# Altium schematic sheet JapaneseLayout_OJP_V0_1_Page_1.SchDoc: Design -> Document Options
size B; Organization: OLogic, Inc.; Revision: A; SheetNumber: 1; SheetTotal: 2; PageSetup: Record=PageOptions|CenterHorizontal=True|CenterVertical=True|PrintScale=0.95|XCorrection=1.00|YCorrection=1.00|PrintKind=1|BorderSize=5000000|LeftOffset=0|BottomOffset=0|Orientation=2|PaperLength=1000|PaperWidth=1000|Scale=100|PaperSource=7|PrintQuality=-4|MediaType=1|DitherType=10|PaperKind=Letter|PrintScaleMode=1
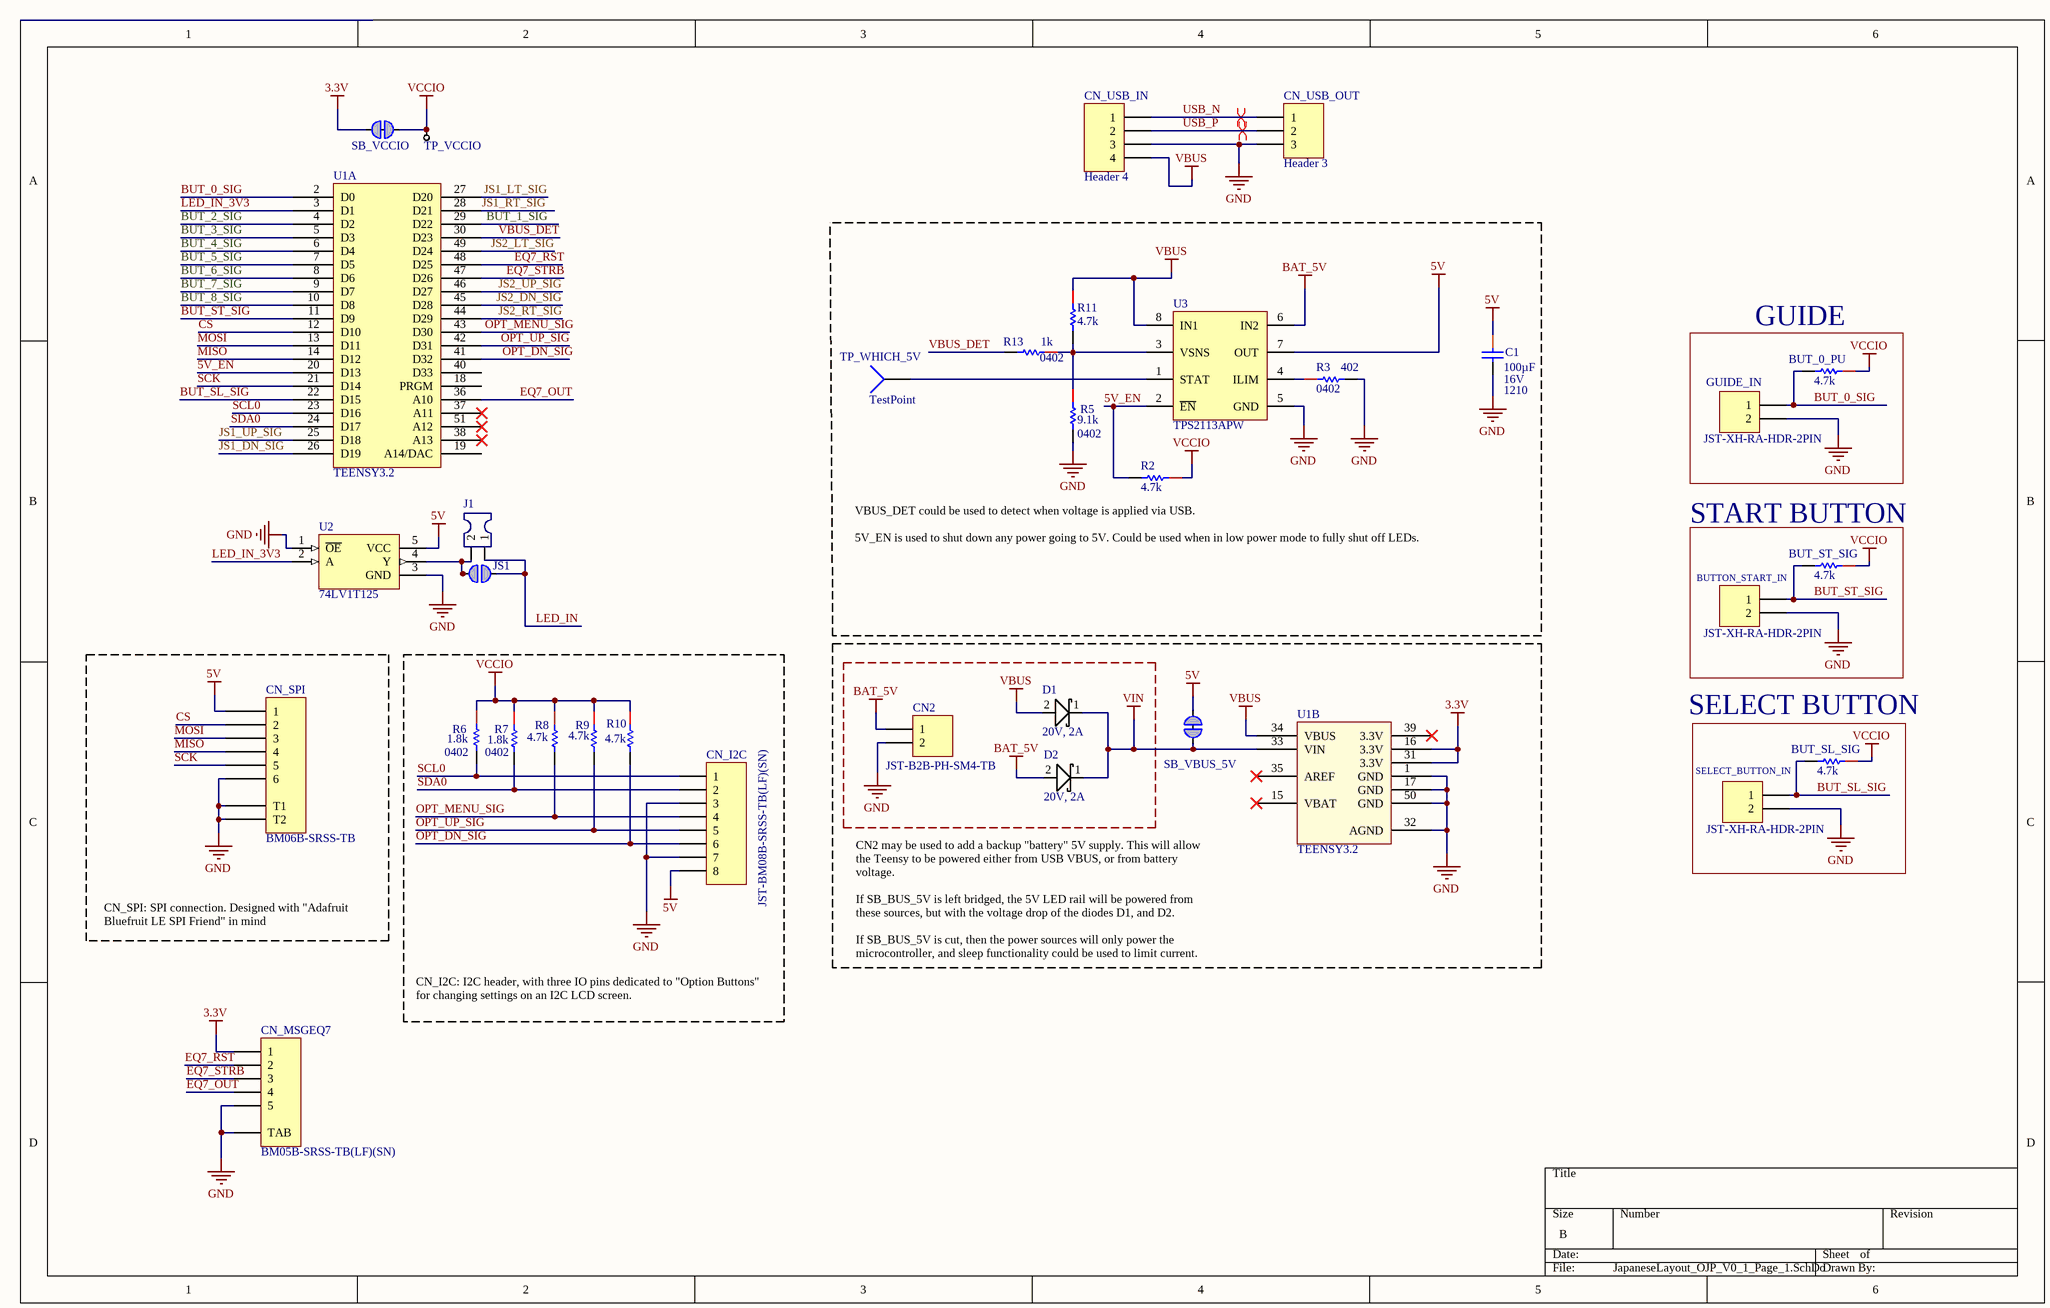
[diagram p0: JapaneseLayout_OJP_V0_1_Page_1.SchDoc]

## Parts
BUT_0_PU  4.7K  [RESC0402(1005)_N]  (no BOM)
BUT_SL_SIG  4.7K  [RESC0402(1005)_N]  (no BOM)
BUT_ST_SIG  4.7K  [RESC0402(1005)_N]  (no BOM)
BUTTON_START_IN  JST-XH-RA-HDR-2PIN  [JST-XH-RA-HDR-2PIN]
C1  Capacitance: 100µF  Voltage - Rated: 16V  Package / Case: 1210  [CAPC1210(3225)_N]  (hidden comment: CAP CER 100UF 16V 20% X5R 1210)
CN2  JST-B2B-PH-SM4-TB  [JST-B2B-PH-SM4-TB]
CN_I2C  JST-BM08B-SRSS-TB(LF)(SN)  [JST-BM08B-SRSS-TB]
CN_MSGEQ7  BM05B-SRSS-TB(LF)(SN)  [New footprint 1]
CN_SPI  BM06B-SRSS-TB  [JST-BM06B-SRSS-TB]
CN_USB_IN  Header 4  [HDR1X4]
CN_USB_OUT  Header 3  [HDR1X3]
D1  Diode - Schottky, 20V, 2A  [DFN80P160X40-2N - PMEG2020EPK,315]  (value not drawn)
D2  Diode - Schottky, 20V, 2A  [DFN80P160X40-2N - PMEG2020EPK,315]  (value not drawn)
GUIDE_IN  JST-XH-RA-HDR-2PIN  [JST-XH-RA-HDR-2PIN]
J1  Jumper 2-Pin  [HDR1X2]  (value not drawn)
JS1  SOLDERBRIDGE  [Solderbridge]  (value not drawn)  (no BOM)
R2  4.7K  [RESC0402(1005)_N]  (no BOM)
R3  Package (Imperial): 0402  [RESC1005X40X25NL05T10]  (hidden comment: 402)
R5  Package (Imperial): 0402  [RESC0402(1005)_M]  (hidden comment: 9.1k)
R6  Package (Imperial): 0402  [RESC0402(1005)_L]  (hidden comment: 1.8K)
R7  Package (Imperial): 0402  [RESC0402(1005)_L]  (hidden comment: 1.8K)
R8  4.7K  [RESC0402(1005)_N]  (no BOM)
R9  4.7K  [RESC0402(1005)_N]  (no BOM)
R10  4.7K  [RESC0402(1005)_N]  (no BOM)
R11  4.7K  [RESC0402(1005)_N]  (no BOM)
R13  Resistance: 1k  Package (Imperial): 0402  [RESC0402(1005)_L]  (hidden comment: RES SMD 1K OHM 1% 1/16W 0402)
SB_VBUS_5V  SOLDERBRIDGE_SHORTED  [Solderbridge_Shorted]  (value not drawn)  (net tie, no BOM)
SB_VCCIO  SOLDERBRIDGE_SHORTED  [Solderbridge_Shorted]  (value not drawn)  (net tie, no BOM)
SELECT_BUTTON_IN  JST-XH-RA-HDR-2PIN  [JST-XH-RA-HDR-2PIN]
TP_VCCIO  TestPoint-PC-W  [TestPoint-TH 40 mil]  (value not drawn)
TP_WHICH_5V  TestPoint  [TestPoint-SM]  (no BOM)
U1  TEENSY3.2  [TEENSY3.2]  (parts A,B of 2)
U2  74LV1T125  [5-TSSOP, SC-70-5, SOT-353]
U3  TPS2113APW  [TSSOP-8, 3x4.40mm]

## Blocks framed on the sheet
GUIDE: BUT_0_PU GUIDE_IN
START BUTTON: BUT_ST_SIG BUTTON_START_IN

## Nets
3.3V: CN_MSGEQ7.1 SB_VCCIO.2 U1.16(3.3V) U1.31(3.3V)
5V: C1.1 CN_I2C.8 CN_SPI.1 SB_VBUS_5V.1 U2.5(VCC) U3.7(OUT)
BAT_5V: CN2.1 D2.2 U3.6(IN2)
GND: BUTTON_START_IN.2 C1.2 CN2.0 CN2.2 CN_I2C.0 CN_I2C.3 CN_I2C.7 CN_MSGEQ7.0(TAB) CN_MSGEQ7.5 CN_SPI.6 CN_SPI.T1 CN_SPI.T2 CN_USB_IN.3 CN_USB_OUT.3 GUIDE_IN.2 R3.2 R5.2 SELECT_BUTTON_IN.2 U1.1(GND) U1.17(GND) U1.32(AGND) U1.50(GND) U2.1(~{OE}) U2.3(GND) U3.5(GND)
VBUS: CN_USB_IN.4 D1.2 R11.1 U1.34(VBUS) U3.8(IN1)
VCCIO: BUT_0_PU.1 BUT_SL_SIG.1 BUT_ST_SIG.1 R2.1 R6.1 R7.1 R8.1 R9.1 R10.1 SB_VCCIO.1 TP_VCCIO.1
VIN: D1.1 D2.1 SB_VBUS_5V.2 U1.33(VIN)
5V_EN: R2.2 U1.20(D13) U3.2(~{EN})
BUT_0_SIG: BUT_0_PU.2 GUIDE_IN.1 U1.2(D0)
BUT_1_SIG: U1.29(D22)
BUT_2_SIG: U1.4(D2)
BUT_3_SIG: U1.5(D3)
BUT_4_SIG: U1.6(D4)
BUT_5_SIG: U1.7(D5)
BUT_6_SIG: U1.8(D6)
BUT_7_SIG: U1.9(D7)
BUT_8_SIG: U1.10(D8)
BUT_SL_SIG: BUT_SL_SIG.2 SELECT_BUTTON_IN.1 U1.22(D15)
BUT_ST_SIG: BUT_ST_SIG.2 BUTTON_START_IN.1 U1.11(D9)
CS: CN_SPI.2 U1.12(D10)
EQ7_OUT: CN_MSGEQ7.4 U1.36(A10)
EQ7_RST: CN_MSGEQ7.2 U1.48(D25)
EQ7_STRB: CN_MSGEQ7.3 U1.47(D26)
JS1_DN_SIG: U1.26(D19)
JS1_LT_SIG: U1.27(D20)
JS1_RT_SIG: U1.28(D21)
JS1_UP_SIG: U1.25(D18)
JS2_DN_SIG: U1.45(D28)
JS2_LT_SIG: U1.49(D24)
JS2_RT_SIG: U1.44(D29)
JS2_UP_SIG: U1.46(D27)
LED_IN: J1.1 JS1.1
LED_IN_3V3: U1.3(D1) U2.2(A)
MISO: CN_SPI.4 U1.14(D12)
MOSI: CN_SPI.3 U1.13(D11)
OPT_DN_SIG: CN_I2C.6 R10.2 U1.41(D32)
OPT_MENU_SIG: CN_I2C.4 R8.2 U1.43(D30)
OPT_UP_SIG: CN_I2C.5 R9.2 U1.42(D31)
SCK: CN_SPI.5 U1.21(D14)
SCL0: CN_I2C.1 R6.2 U1.23(D16)
SDA0: CN_I2C.2 R7.2 U1.24(D17)
USB_N: CN_USB_IN.1 CN_USB_OUT.1
USB_P: CN_USB_IN.2 CN_USB_OUT.2
VBUS_DET: R13.2 U1.30(D23)
NetJ1_2: J1.2 JS1.2 U2.4(Y)
NetR3_1: R3.1 U3.4(ILIM)
NetR5_1: R5.1 R11.2 R13.1 U3.3(VSNS)
NetTP_WHICH_5V_1: TP_WHICH_5V.1 U3.1(STAT)

Not connected (* = marked no-connect by the designer): U1 15(VBAT)* 18(PRGM) 19(A14/DAC) 35(AREF)* 37(A11)* 38(A13)* 39(3.3V)* 40(D33) 51(A12)*

## Layout directives
differential pair: USB_N, USB_P

## Notes on the sheet
- (near R2) VBUS_DET could be used to detect when voltage is applied via USB.
  5V_EN is used to shut down any power going to 5V. Could be used when in low power mode to fully shut off LEDs.
- (near BUT_SL_SIG) SELECT BUTTON
- CN_SPI: SPI connection. Designed with "Adafruit Bluefruit LE SPI Friend" in mind
- CN2 may be used to add a backup "battery" 5V supply. This will allow the Teensy to be powered either from USB VBUS, or from battery voltage.
  If SB_BUS_5V is left bridged, the 5V LED rail will be powered from these sources, but with the voltage drop of the diodes D1, and D2.
  If SB_BUS_5V is cut, then the power sources will only power the microcontroller, and sleep functionality could be used to limit current.
- CN_I2C: I2C header, with three IO pins dedicated to "Option Buttons" for changing settings on an I2C LCD screen.
- Title
- By:
- Date:
- Number:
- Time:
- Revision:
- Sheet
- of
- OLogic, Inc.
- 3350 Scott Blvd. Bldg 47
- Santa Clara, CA
- 95054 USA
- File:
- (650) 996-1490
- (in symbol CMP-009-0002-01) 20V, 2A

## Library data of the parts
BUT_0_PU BUT_SL_SIG BUT_ST_SIG R2 R8-R11 = CMP-007-0497-12: RES 4.7K OHM 1% 1/10W 0402; Power: 100mW; Temperature Coefficient: 100ppm/°C; Package_Imperial: 0402; Package_Metric: 1005; Termination: SMD/SMT; Resistance: 4.7k; Tolerance: 1%; Width: 500µm; Length: 1mm; Height: 550µm
BUTTON_START_IN GUIDE_IN SELECT_BUTTON_IN = CMP-001-1623-04: 2.5 mm JST XH-Style Shrouded Male Connector: 2-Pin, Right Angle; Pololu #2718
C1 = CMP-007-0076-01: 100uF 1210; Manufacturer Part Number: EMK325ABJ107MM-T; Manufacturer: Taiyo Yuden; Pricing 1: 1=2.3, 10=1.882, 50=1.6524, 100=1.3311, 250=1.1016 (USD); Height - Seated (Max): -; RoHS: RoHS Compliant; Tolerance: ±20%; Component Name: CAP CER 100UF 16V 20% X5R 1210; Operating Temperature: -55°C ~ 85°C; Features: -; Ratings: -; Applications: General Purpose; Pin Count: 2; Packaging: Cut Tape (CT); Stock 1: 220900; Lead Style: -; Temperature Coefficient: X5R; Designator: CAP CER 100UF 16V 20% X5R 1210; Mounting Type: Surface Mount, MLCC; Lead Spacing: -; ComponentLink1Description: http://www.yuden.co.jp/productdata/catalog/en/mlcc_all_e.pdf; ComponentLink1URL: http://www.yuden.co.jp/productdata/catalog/en/mlcc_all_e.pdf
CN2 = CMP-001-0353-01: 2mm Locking Header, 2-Pin; Manufacturer: JST; Manufacturer Part Number: B2B-PH-SM4-TB(LF)(SN); PN: 455-1734-1-ND; Number of Positions: 2; Number of Positions Loaded: All; Vendor: Digikey; Connector Type: Header, Shrouded; Contact Finish: Tin; Contact Type: Male Pin; Pin Count: 3; Termination: Solder; ComponentLink1URL: http://www.jst-mfg.com/product/pdf/eng/ePH.pdf; ComponentLink1Description: http://www.jst-mfg.com/product/pdf/eng/ePH.pdf; Contact Finish Thickness: -; RoHS: RoHS Compliant; Number of Rows: 1; Row Spacing: -; Designator: JST-B2B-PH-SM4-TB; Contact Mating Length: -; Packaging: Cut Tape (CT); Mounting Type: Surface Mount; Stock 1: 43142; Fastening Type: -; Features: Solder Retention; Pricing 1: 1=0.51, 10=0.478, 50=0.3824, 100=0.3664, 250=0.33456, 500=0.31862 (USD); Color: Natural; Component Name: JST-B2B-PH-SM4-TB; MPN: B2B-PH-SM4-TB(LF)(SN)
CN_I2C = CMP-001-0374-01: 1mm Locking Header, 8-Pin; Manufacturer: Japan Solderless Terminals (JST); No of Positions: 8; Style/Orientation: Vertical Header/Plug; Component Name: JST-BM08B-SRSS-TB(LF)(SN); ComponentLink1URL: https://datasheet.ciiva.com/730/esr-730608.pdf; ComponentLink5Description: https://datasheet.ciiva.com/8052/91630-8052091.pdf; ComponentLink2Description: https://datasheet.ciiva.com/26894/getdatasheetpartid-640965-26894529.pdf; Type: Shrouded Header; ComponentLink1Description: https://datasheet.ciiva.com/730/esr-730608.pdf; Designator: JST-BM08B-SRSS-TB(LF)(SN); Pitch: 1 mm; ComponentLink4Description: https://datasheet.ciiva.com/712/esr-712617.pdf; Stock 1: 18919; Pricing 1: 1=0.93, 10=0.814, 100=0.7024, 500=0.5747 (USD); Manufacturer Part Number: BM08B-SRSS-TB(LF)(SN); ComponentLink5URL: https://datasheet.ciiva.com/8052/91630-8052091.pdf; ComponentLink6URL: https://datasheet.ciiva.com/16380/esr-16380526.pdf; ComponentLink3Description: https://datasheet.ciiva.com/712/esr-712616.pdf; ComponentLink6Description: https://datasheet.ciiva.com/16380/esr-16380526.pdf; ComponentLink2URL: https://datasheet.ciiva.com/26894/getdatasheetpartid-640965-26894529.pdf; ComponentLink4URL: https://datasheet.ciiva.com/712/esr-712617.pdf; Termination: Solder; Pin Count: 9; ComponentLink3URL: https://datasheet.ciiva.com/712/esr-712616.pdf
CN_MSGEQ7 = CMP-00047-05: CONN HEADER SH 5POS TOP 1MM TIN; Voltage Rating (AC): 50V; Gender: Male; Contact Resistance: 40mR; Connector Type: Male Pin; Insulation Resistance: 100MR; Current Rating: 1A; Number of Positions: 5; Mount: Surface Mount; Depth: 2.9mm; Housing Colour: Beige; Flammability Rating: UL94 V-0; Contact Plating: Copper, Tin, Lead; Material: Polyamide; Number of Rows: 1; Colour: Natural; Lead Pitch: 1mm; Orientation: Straight; Max Voltage Rating (AC): 50V; Min Operating Temperature: -25°C; Lead Free: Lead Free; Pitch: 1mm; Length: 7mm; Max Operating Temperature: 85°C; REACH SVHC: No SVHC; Termination: Solder; Voltage Rating: 50V; Contact Material: Copper Alloy; Number of Contacts: 5; Packaging: Tape and Reel; Housing Material: Polyamide; Max Current Rating: 1A
CN_SPI = CMP-001-0179-04: 1mm x 6pin Polarized Vert Connector; MPN: BM068-SRSS-TB; Manufacturer: SH Connector; Insulation Resistance: 100MR; Gender: Male; Connector Type: Male Pin; Vendor: SparkFun; Number of Positions: 6; Current Rating: 1A; Pitch: 0.039inch; Voltage Rating (AC): 50V; Contact Resistance: 20mR; Termination: Solder; REACH SVHC: No SVHC; Pin Count: 6; Lead Pitch: 1mm; Housing Colour: Natural; Orientation: Straight; Min Operating Temperature: -25°C; Number of Rows: 1; Housing Material: Nylon; Colour: Natural; Material: Polyamide; Component Name: BM06B-SRSS-TB; Max Operating Temperature: 85°C; Flammability Rating: UL94 V-0; Number of Contacts: 6; Series: SH; Contact Plating: Tin, Lead; Lead Free: Lead Free; Contact Material: Copper Alloy; Voltage Rating: 50V; Mount: Surface Mount; Packaging: Tape and Reel; Designator: BM06B-SRSS-TB
CN_USB_IN = CMP-001-0298-01: Header, 4-Pin; Manufacturer Part Number: PRPC004SAAN-RC; Manufacturer: Sullins Connector Solutions; Number of Positions Loaded: All; Connector Type: Header, Unshrouded, Breakaway; Number of Positions: 4; Number of Rows: 1; Contact Finish: Gold; Stock 1: 0; Color: Black; Contact Finish Thickness: Flash; Row Spacing: -; Packaging: Bulk; Component Name: Header 4; Contact Type: Male Pin; Mounting Type: Through Hole; Pin Count: 4; Termination: Solder; ComponentLink1Description: http://media.digikey.com/PDF/Data%20Sheets/Sullins%20PDFs/xRxCzzzSxxN-RC_ST_11635-B.pdf; ComponentLink1URL: http://media.digikey.com/PDF/Data%20Sheets/Sullins%20PDFs/xRxCzzzSxxN-RC_ST_11635-B.pdf; Fastening Type: -; Features: -; Pricing 1: 1=0.2, 10=0.175, 100=0.1443, 500=0.1141, 1000=0.09794, 5000=0.08935, 10000=0.08591 (USD); RoHS: RoHS Compliant; Designator: Header 4
CN_USB_OUT = CMP-001-0290-01: Header, 3-Pin; Manufacturer Part Number: PRPC003SAAN-RC; Manufacturer: Sullins Connector Solutions; Number of Positions: 3; Number of Positions Loaded: All; Connector Type: Header, Unshrouded, Breakaway; ComponentLink1URL: http://media.digikey.com/PDF/Data%20Sheets/Sullins%20PDFs/xRxCzzzSxxN-RC_ST_11635-B.pdf; Component Name: Header 3; Termination: Solder; Designator: Header 3; ComponentLink1Description: http://media.digikey.com/PDF/Data%20Sheets/Sullins%20PDFs/xRxCzzzSxxN-RC_ST_11635-B.pdf; Number of Rows: 1; Mounting Type: Through Hole; RoHS: RoHS Compliant; Stock 1: 0; Pin Count: 3; Features: -; Row Spacing: -; Packaging: Bulk; Contact Finish Thickness: Flash; Color: Black; Pricing 1: 1=0.18, 10=0.16, 100=0.132, 500=0.10438, 1000=0.0896, 5000=0.08174, 10000=0.0786 (USD); Contact Type: Male Pin; Fastening Type: -; Contact Finish: Gold
D1 D2 = CMP-009-0002-01: Diode Schottky 20V 2A Surface Mount DFN1608D-2; Manufacturer 1: Nexperia; Manufacturer Part Number 1: PMEG2020EPK,315; ComponentLink3URL: https://assets.nexperia.com/documents/data-sheet/PMEG2020EPK.pdf?src-supplier=Digi-Key; ComponentLink1Description: Vendor Web Page; Source: gen3 stepper2.SchLib; Design Item ID: Diode - Schottky, 20V, 2A; ComponentLink1URL: https://www.digikey.com/product-detail/en/nexperia-usa-inc/PMEG2020EPK315/1727-1338-1-ND/4386356; Stock 1: 277942; ComponentLink2URL: https://assets.nexperia.com/documents/data-sheet/PMEG2020EPK.pdf; ComponentLink3Description: https://assets.nexperia.com/documents/data-sheet/PMEG2020EPK.pdf?src-supplier=Digi-Key; ComponentLink2Description: Datasheet; Pricing 1: 1=0.47, 10=0.352, 100=0.2192, 500=0.14996, 1000=0.11536 (USD)
J1 = CMP-001-0412-01: Junper 2-Pin; Manufacturer Part Number: PRPC002SAAN-RC; Manufacturer: Sullins Connector Solutions; Number of Positions: 2; Connector Type: Header, Unshrouded, Breakaway; Number of Positions Loaded: All; Pin Count: 2; Contact Finish: Gold; Component Name: Jumper 2-Pin; Termination: Solder; Stock 1: 4300; Contact Finish Thickness: Flash; ComponentLink1URL: http://media.digikey.com/PDF/Data%20Sheets/Sullins%20PDFs/xRxCzzzSxxN-RC_ST_11635-B.pdf; Contact Type: Male Pin; Fastening Type: -; Features: -; Mounting Type: Through Hole; Pricing 1: 1=0.16, 10=0.145, 100=0.1198, 500=0.09466, 1000=0.08127, 5000=0.07414, 10000=0.07129 (USD); Designator: Jumper 2-Pin; RoHS: RoHS Compliant; Packaging: Bulk; Row Spacing: -; Number of Rows: 1; ComponentLink1Description: http://media.digikey.com/PDF/Data%20Sheets/Sullins%20PDFs/xRxCzzzSxxN-RC_ST_11635-B.pdf; Color: Black
JS1 = CMP-001-0538-01: Artikkelnr Simpro: N.A.; Component Name: SOLDERBRIDGE; Footprint Doc: Solderbridge; Manufacturer Part Number: *; 2nd source Supplier: *; Value: Solderbridge; Published: 2009-12-14; Publisher: Nordic Semiconductor; Manufacturer: *; Datasheet: *; Designator: SOLDERBRIDGE; Note: *; 2nd source part number: *; LatestRevisionDate: 2009-12-14; Part Number: Solderbridge; Artikkelnr Noca: N.A.; Pin Count: 2
R3 = CMP-001-1634-01: RES 402 OHM 1% 1/16W 0402; Power Rating: 63mW; Package (Metric): 1005; Working Voltage: 50V; Temperature Coefficient: 100ppm/°C; Resistance: 402; Termination: SMD/SMT; Max Operating Temperature: 155°C; Width: 508µm; Tolerance: 1%; Depth: 0.5mm; Power: 63mW; Length: 990.6µm; Min Operating Temperature: -55°C; Max Power Dissipation: 63mW; Height: 406.4µm
R5 = CMP-00084-12: RES SMD 9.1K OHM 1% 1/10W 0402; Power: 63mW; Package (Metric): 1005; Temperature Coefficient: 100ppm/°C; Termination: SMD/SMT; Length: 1mm; Tolerance: 1%; Resistance: 9.1k; Height: 400µm
R6 R7 = CMP-00034-15: CAP CER 1.8K 1/16W 1% 0402; Temperature Coefficient: 100ppm/°C; Package (Metric): 1005; Power: 63mW; Resistance: 1.8k; Length: 1mm; Tolerance: 1%; Height: 400µm; Termination: SMD/SMT
R13 = CMP-007-0405-14: 1k ±1% 0.063W, 1/16W Chip Resistor 0402 (1005 Metric) Moisture Resistant Thick FilmRES 1K OHM 1% 1/16W 0402; Manufacturer: Yageo; Manufacturer Part Number: RC0402FR-071KL; Power: 63mW; Package (Metric): 1005; Temperature Coefficient: 100ppm/°C; Supplier Part Number: 311-1.00KLRCT-ND; Supplier: Digi-Key; Height: 400µm; Termination: SMD/SMT; Composition: Thick Film; Width: 500µm; Tolerance: 1%
SB_VBUS_5V SB_VCCIO = CMP-001-0539-01: Shorted Solderbridge; Part Number: Solderbridge Shorted; Artikkelnr Noca: N.A.; Footprint Doc: Solderbridge_Shorted; Datasheet: *; 2nd source Supplier: *; LatestRevisionDate: 2012-08-07; Published: 2012-08-07; Publisher: Nordic Semiconductor; Manufacturer: *; Designator: SOLDERBRIDGE_SHORTED; Value: Solderbridge; Pin Count: 2; Component Name: SOLDERBRIDGE_SHORTED; 2nd source part number: *; Manufacturer Part Number: *; Note: *; Artikkelnr Simpro: N.A.
TP_VCCIO = CMP-005-0212-01: Test Point White; Manufacturer: Keystone Electronics; Manufacturer Part Number: 5002; Material - Insulation: Nylon 46, UL 94V-0; Plating: Silver; Material - Body: Phosphor Bronze; Pin Count: 1; ComponentLink1URL: http://www.keyelco.com/product-pdf.cfm?p=1311; RoHS: RoHS Compliant; Type: PC Test Point, Miniature; Packaging: Bulk; Stock 1: 329102; Height: -; Color: White; Designator: TestPoint-PC-W; Component Name: TestPoint-PC-W; ComponentLink1Description: http://www.keyelco.com/product-pdf.cfm?p=1311; Pricing 1: 1=0.37, 10=0.316, 50=0.2298, 100=0.2209, 250=0.19832, 1000=0.1616, 2500=0.14424, 5000=0.13523 (USD); Part Status: Active
TP_WHICH_5V = CMP-005-0208-01: Test Point; Component Name: TestPoint; Pin Count: 1; Designator: TestPoint
U1 = CMP-001-1631-02
U2 = CMP-00282-01: Buffer, Non-Inverting 1 Element 1 Bit per Element 3-State Output 5-TSSOP
U3 = CMP-001-1632-02: OR Controller Source Selector Switch N-Channel 2:1 8-TSSOP; Operating Supply Current: 55uA; On-State Resistance: 84mR; Output Current: 1.25A; Number of Inputs: 2; Number of Outputs: 1; Operating Supply Voltage: 5.5V; Turn-Off Delay Time: 5ms; Max Power Dissipation: 387mW; Min Input Voltage: 2.8V; Turn-On Delay Time: 1ms; Min Operating Temperature: -40°C; Width: 4.4mm; Weight: 0.001376oz; Number of Pins: 8; Max Output Current: 1.25A; Length: 3mm; REACH SVHC: No SVHC; Lead Free: Lead Free; Case/Package: TSSOP; Max Operating Temperature: 85°C; Max Input Voltage: 5.5V; Packaging: Rail/Tube; Series: TPS2113A; Package Quantity: 150; Height: 1.15mm; Current - Output 2: 1.25A; Radiation Hardening: No; RoHS Compliant: Yes